# Altium schematic sheet Concentrator.SchDoc
size A2
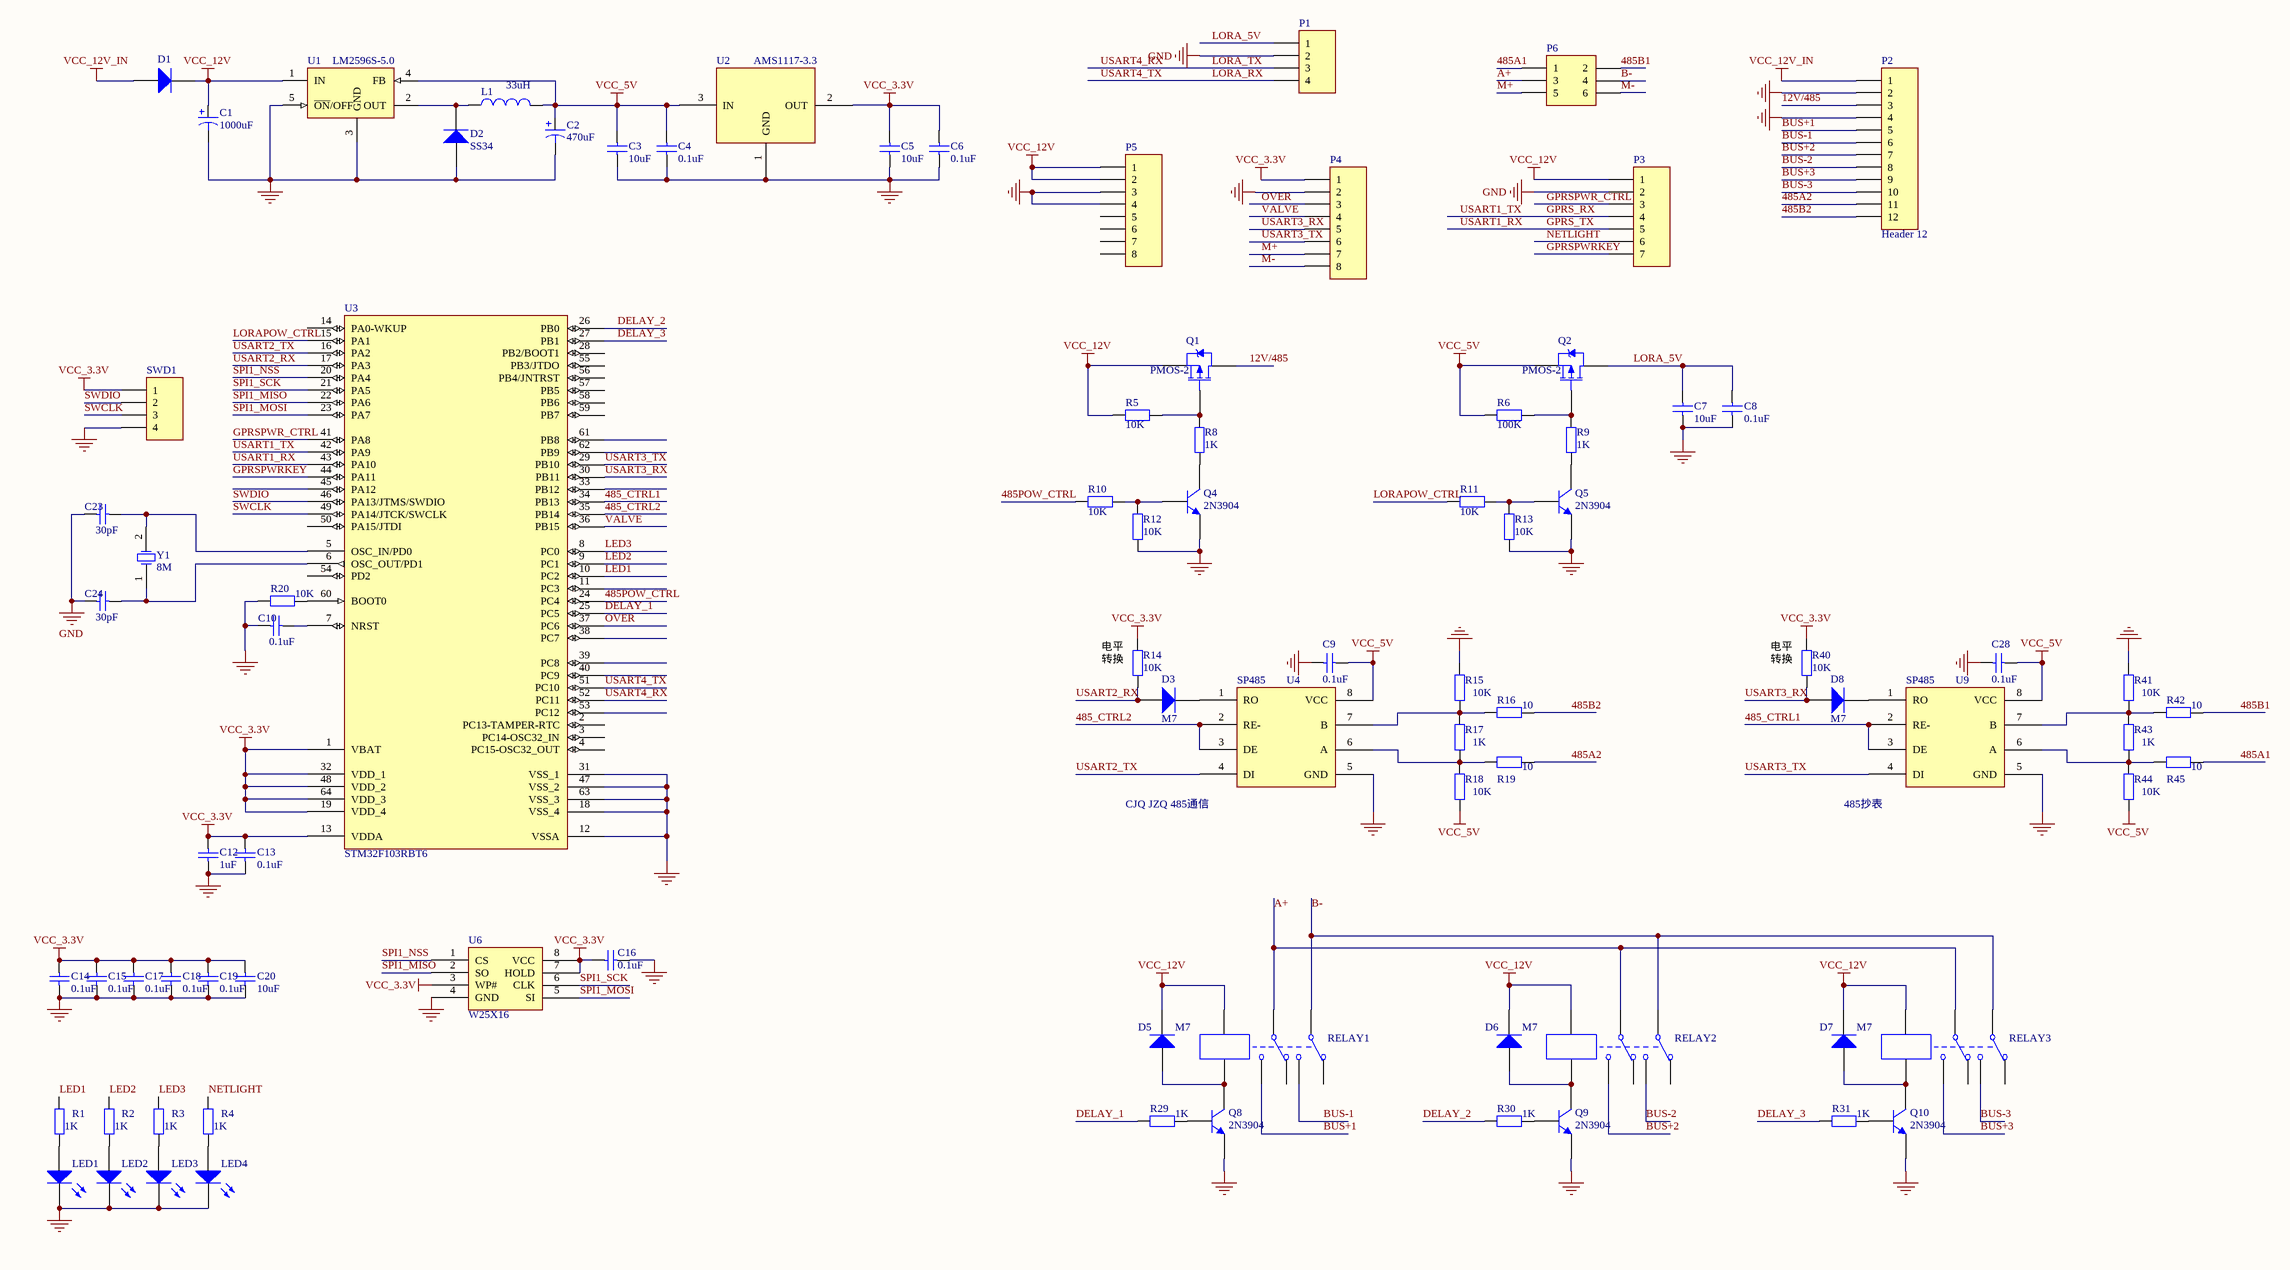
[diagram p0: Concentrator.SchDoc]

## Parts
C1  value 1000uF  [C_DJ - duplicate]  (hidden comment: Cap Pol1)
C2  value 470uF  [C_DJ - duplicate]  (hidden comment: Cap Pol1)
C3  value 10uF  [0805]  (hidden comment: Cap)
C4  value 0.1uF  [0603]  (hidden comment: Cap)
C5  value 10uF  [0805]  (hidden comment: Cap)
C6  value 0.1uF  [0603]  (hidden comment: Cap)
C7  value 10uF  [0805]  (hidden comment: Cap)
C8  value 0.1uF  [0603]  (hidden comment: Cap)
C9  value 0.1uF  [0603]  (hidden comment: Cap)
C10  value 0.1uF  [0603]  (hidden comment: Cap)
C12  value 1uF  [0603]  (hidden comment: Cap)
C13  value 0.1uF  [0603]  (hidden comment: Cap)
C14  value 0.1uF  [0603]  (hidden comment: Cap)
C15  value 0.1uF  [0603]  (hidden comment: Cap)
C16  value 0.1uF  [0603]  (hidden comment: Cap)
C17  value 0.1uF  [0603]  (hidden comment: Cap)
C18  value 0.1uF  [0603]  (hidden comment: Cap)
C19  value 0.1uF  [0603]  (hidden comment: Cap)
C20  value 10uF  [0805]  (hidden comment: Cap)
C23  value 30pF  [0603]  (hidden comment: Cap)
C24  value 30pF  [0603]  (hidden comment: Cap)
C28  value 0.1uF  [0603]  (hidden comment: Cap)
D1  Diode 1N4007  [M7-4007]  (value not drawn)
D2  SS34  [M7-4007]
D3  M7  [M7-4007]
D5  M7  [M7-4007]
D6  M7  [M7-4007]
D7  M7  [M7-4007]
D8  M7  [M7-4007]
L1  value 33uH  [L12*12]  (hidden comment: Inductor)
LED1  LED  [LED]  (value not drawn)
LED2  LED  [LED]  (value not drawn)
LED3  LED  [LED]  (value not drawn)
LED4  LED  [LED]  (value not drawn)
P1  Header 4  [HDR1X4]  (value not drawn)
P2  Header 12  [P12]
P3  Header 7  [HDR1X7]  (value not drawn)
P4  Header 8  [HDR1X8]  (value not drawn)
P5  Header 8  [HDR1X8]  (value not drawn)
P6  Header 3X2  [HDR2X3]  (value not drawn)
Q1  PMOS-2  [78M05/20]
Q2  PMOS-2  [78M05/20]
Q4  2N3904  [NPN-PNP]
Q5  2N3904  [NPN-PNP]
Q8  2N3904  [NPN-PNP]
Q9  2N3904  [NPN-PNP]
Q10  2N3904  [NPN-PNP]
R1  value 1K  [0603]  (hidden comment: Res2)
R2  value 1K  [0603]  (hidden comment: Res2)
R3  value 1K  [0603]  (hidden comment: Res2)
R4  value 1K  [0603]  (hidden comment: Res2)
R5  value 10K  [0603]  (hidden comment: Res2)
R6  value 100K  [0603]  (hidden comment: Res2)
R8  value 1K  [0603]  (hidden comment: Res2)
R9  value 1K  [0603]  (hidden comment: Res2)
R10  value 10K  [0603]  (hidden comment: Res2)
R11  value 10K  [0603]  (hidden comment: Res2)
R12  value 10K  [0603]  (hidden comment: Res2)
R13  value 10K  [0603]  (hidden comment: Res2)
R14  value 10K  [0603]  (hidden comment: Res2)
R15  value 10K  [0603]  (hidden comment: Res2)
R16  value 10  [0603]  (hidden comment: Res2)
R17  value 1K  [0603]  (hidden comment: Res2)
R18  value 10K  [0603]  (hidden comment: Res2)
R19  value 10  [0603]  (hidden comment: Res2)
R20  value 10K  [0603]  (hidden comment: Res2)
R29  value 1K  [0603]  (hidden comment: Res2)
R30  value 1K  [0603]  (hidden comment: Res2)
R31  value 1K  [0603]  (hidden comment: Res2)
R40  value 10K  [0603]  (hidden comment: Res2)
R41  value 10K  [0603]  (hidden comment: Res2)
R42  value 10  [0603]  (hidden comment: Res2)
R43  value 1K  [0603]  (hidden comment: Res2)
R44  value 10K  [0603]  (hidden comment: Res2)
R45  value 10  [0603]  (hidden comment: Res2)
RELAY1  Relay-DPDT  [Relay-DPDP]  (value not drawn)
RELAY2  Relay-DPDT  [Relay-DPDP]  (value not drawn)
RELAY3  Relay-DPDT  [Relay-DPDP]  (value not drawn)
SWD1  SWD  [HDR1X4]  (value not drawn)
U1  LM2596S-5.0  [TO-263-5]
U2  AMS1117-3.3  [AMS-1117]
U3  STM32F103RBT6  [LQFP64_M]
U4  SP485  [SOP8]
U6  W25X16  [W24X16]
U9  SP485  [SOP8]
Y1  8M  [OSC]

## Nets
GND: C1.2 C2.2 C3.1 C4.1 C5.1 C6.1 C7.1 C8.1 C9.2 C10.1 C12.1 C13.1 C14.1 C15.1 C16.1 C17.1 C18.1 C19.1 C20.1 C23.1 C24.1 C28.2 D2.1(A) LED1.K LED2.K LED3.K LED4.K P1.2 P2.2 P2.4 P3.2 P4.2 P5.3 P5.4 Q4.E Q5.E Q8.E Q9.E Q10.E R12.1 R13.1 R15.1 R20.1 R41.1 SWD1.4 U1.3(GND) U1.5(~{ON}/OFF) U2.1(GND) U3.12(VSSA) U3.18(VSS_4) U3.31(VSS_1) U3.47(VSS_2) U3.63(VSS_3) U4.5(GND) U6.4(GND) U9.5(GND)
VCC_3.3V: C5.2 C6.2 C12.2 C13.2 C14.2 C15.2 C16.2 C17.2 C18.2 C19.2 C20.2 P4.1 R14.1 R40.1 SWD1.1 U2.2(OUT) U3.1(VBAT) U3.13(VDDA) U3.19(VDD_4) U3.32(VDD_1) U3.48(VDD_2) U3.64(VDD_3) U6.3(WP#) U6.7(HOLD) U6.8(VCC)
VCC_5V: C2.1 C3.2 C4.2 C9.1 C28.1 L1.2 Q2.3(S) R6.2 R18.2 R44.2 U1.4(FB) U2.3(IN) U4.8(VCC) U9.8(VCC)
VCC_12V: C1.1 D1.2(K) D5.2(K) D6.2(K) D7.2(K) P3.1 P5.1 P5.2 Q1.3(S) R5.2 RELAY1.7 RELAY2.7 RELAY3.7 U1.1(IN)
VCC_12V_IN: D1.1(A) P2.1
12V/485: P2.3 Q1.2(D)
485_CTRL1: U3.34(PB13) U9.2(RE-) U9.3(DE)
485_CTRL2: U3.35(PB14) U4.2(RE-) U4.3(DE)
485A1: P6.1 R45.2
485A2: P2.11 R19.2
485B1: P6.2 R42.2
485B2: P2.12 R16.2
485POW_CTRL: R10.1 U3.24(PC4)
A+: P6.3 RELAY1.4 RELAY2.4 RELAY3.4
B-: P6.4 RELAY1.1 RELAY2.1 RELAY3.1
BUS+1: P2.5 RELAY1.6
BUS+2: P2.7 RELAY2.6
BUS+3: P2.9 RELAY3.6
BUS-1: P2.6 RELAY1.3
BUS-2: P2.8 RELAY2.3
BUS-3: P2.10 RELAY3.3
DELAY_1: R29.1 U3.25(PC5)
DELAY_2: R30.1 U3.26(PB0)
DELAY_3: R31.1 U3.27(PB1)
GPRS_RX: P3.4 U3.42(PA9)  [also labelled USART1_TX]
GPRS_TX: P3.5 U3.43(PA10)  [also labelled USART1_RX]
GPRSPWR_CTRL: P3.3 U3.41(PA8)
GPRSPWRKEY: P3.7 U3.44(PA11)
LED1: R1.1 U3.10(PC2)
LED2: R2.1 U3.9(PC1)
LED3: R3.1 U3.8(PC0)
LORA_5V: C7.2 C8.2 P1.1 Q2.2(D)
LORA_RX: P1.4 U3.51(PC10)  [also labelled USART4_TX]
LORA_TX: P1.3 U3.52(PC11)  [also labelled USART4_RX]
LORAPOW_CTRL: R11.1 U3.15(PA1)
M+: P4.7 P6.5
M-: P4.8 P6.6
NETLIGHT: P3.6 R4.1
OVER: P4.3 U3.37(PC6)
SPI1_MISO: U3.22(PA6) U6.2(SO)
SPI1_MOSI: U3.23(PA7) U6.5(SI)
SPI1_NSS: U3.20(PA4) U6.1(CS)
SPI1_SCK: U3.21(PA5) U6.6(CLK)
SWCLK: SWD1.3 U3.49(PA14/JTCK/SWCLK)
SWDIO: SWD1.2 U3.46(PA13/JTMS/SWDIO)
USART2_RX: D3.1(A) R14.2 U3.17(PA3)
USART2_TX: U3.16(PA2) U4.4(DI)
USART3_RX: D8.1(A) P4.5 R40.2 U3.30(PB11)
USART3_TX: P4.6 U3.29(PB10) U9.4(DI)
VALVE: P4.4 U3.36(PB15)
NetC10_2: C10.2 U3.7(NRST)
NetC23_2: C23.2 U3.5(OSC_IN/PD0) Y1.2(OSC2)
NetC24_2: C24.2 U3.6(OSC_OUT/PD1) Y1.1(OSC1)
NetD2_2: D2.2(K) L1.1 U1.2(OUT)
NetD3_2: D3.2(K) U4.1(RO)
NetD5_1: D5.1(A) Q8.C RELAY1.8
NetD6_1: D6.1(A) Q9.C RELAY2.8
NetD7_1: D7.1(A) Q10.C RELAY3.8
NetD8_2: D8.2(K) U9.1(RO)
NetLED1_A: LED1.A R1.2
NetLED2_A: LED2.A R2.2
NetLED3_A: LED3.A R3.2
NetLED4_A: LED4.A R4.2
NetQ1_1: Q1.1(G) R5.1 R8.2
NetQ2_1: Q2.1(G) R6.1 R9.2
NetQ4_B: Q4.B R10.2 R12.2
NetQ4_C: Q4.C R8.1
NetQ5_B: Q5.B R11.2 R13.2
NetQ5_C: Q5.C R9.1
NetQ8_B: Q8.B R29.2
NetQ9_B: Q9.B R30.2
NetQ10_B: Q10.B R31.2
NetR15_2: R15.2 R16.1 R17.1 U4.7(B)
NetR17_2: R17.2 R18.1 R19.1 U4.6(A)
NetR20_2: R20.2 U3.60(BOOT0)
NetR41_2: R41.2 R42.1 R43.1 U9.7(B)
NetR43_2: R43.2 R44.1 R45.1 U9.6(A)

Not connected (* = marked no-connect by the designer): P5 5 6 7 8; RELAY1 2 5; RELAY2 2 5; RELAY3 2 5; U2 4(OUT); U3 2(PC13-TAMPER-RTC) 3(PC14-OSC32_IN) 4(PC15-OSC32_OUT) 11(PC3) 14(PA0-WKUP) 28(PB2/BOOT1) 33(PB12) 38(PC7) 39(PC8) 40(PC9) 45(PA12) 50(PA15/JTDI) 53(PC12) 54(PD2) 55(PB3/JTDO) 56(PB4/JNTRST) 57(PB5) 58(PB6) 59(PB7) 61(PB8) 62(PB9)

## Notes on the sheet
- (near R14) 电平
  转换
- (near R40) 电平
  转换
- (near U4) CJQ JZQ 485通信
- (near U9) 485抄表

## Library data of the parts
C1 C2 = Cap Pol1: Polarized Capacitor (Radial); Published: 8-Jun-2000; LatestRevisionDate: 17-Jul-2002; LatestRevisionNote: Re-released for DXP Platform.; PackageReference: RB7.6-15; Publisher: Altium Limited
C3-C10 C12-C20 C23 C24 C28 = Cap: Capacitor; Published: 8-Jun-2000; LatestRevisionDate: 17-Jul-2002; LatestRevisionNote: Re-released for DXP Platform.; PackageReference: RAD-0.3; Publisher: Altium Limited
D1-D3 D5-D8 = Diode 1N4007: 1 Amp General Purpose Rectifier; Published: 8-Jun-2000; LatestRevisionDate: 17-Jul-2002; LatestRevisionNote: Re-released for DXP Platform.; PackageReference: DO-41; Publisher: Altium Limited; Code_JEDEC: DO-204-AL; ComponentLink1Description: Manufacturer Link; ComponentLink1URL: http://www.fairchildsemi.com/; ComponentLink2Description: Datasheet; ComponentLink2URL: http://www.fairchildsemi.com/ds/1N%2F1N4001.pdf
  D1 D2: DatasheetVersion: 1998; PackageVersion: Aug-1999
  D3 D5-D8: DatasheetDocument: 1998; PackageDocument: Aug-1999
L1 = Inductor: Code_IEC: 1005; Published: 8-Jun-2000; LatestRevisionDate: 29-May-2009; LatestRevisionNote: IPC-7351 Footprint Added.; PackageReference: 0402-A; Publisher: Altium Limited; PackageDescription: Chip Inductor; Code_JEITA: 0402
LED1-LED4 = LED0: Typical INFRARED GaAs LED; Published: 8-Jun-2000; LatestRevisionDate: 08-Jul-2005; LatestRevisionNote: Mech Layer 1 removed.; PackageReference: LED-0; Publisher: Altium Limited
P1 SWD1 = Header 4: Header, 4-Pin; LatestRevisionDate: 17-Jul-2002; LatestRevisionNote: Re-released for DXP Platform.; Publisher: Altium Limited
P2 = Header 12: Header, 12-Pin; LatestRevisionDate: 17-Jul-2002; LatestRevisionNote: Re-released for DXP Platform.; Publisher: Altium Limited
P3 = Header 7: Header, 7-Pin; LatestRevisionDate: 17-Jul-2002; LatestRevisionNote: Re-released for DXP Platform.; Publisher: Altium Limited
P4 P5 = Header 8: Header, 8-Pin; LatestRevisionDate: 17-Jul-2002; LatestRevisionNote: Re-released for DXP Platform.; Publisher: Altium Limited
P6 = Header 3X2: Header, 3-Pin, Dual row; LatestRevisionDate: 17-Jul-2002; LatestRevisionNote: Re-released for DXP Platform.; Publisher: Altium Limited
Q1 Q2 = PMOS-2: P-Channel Power MOSFET; Note: Pin 4 not drawn and electrically connected to Pin 2.; Published: 8-Jun-2000; LatestRevisionDate: 17-Jul-2002; LatestRevisionNote: Re-released for DXP Platform.; DatasheetVersion: PD-9.390D; PackageReference: TO-220AB; Publisher: Altium Limited; Code_JEDEC: TO-220-AB; ComponentLink1Description: Manufacturer Link; ComponentLink1URL: http://www.irf.com/
Q4 Q5 Q8-Q10 = 2N3904: NPN General Purpose Amplifier; Published: 8-Jun-2000; LatestRevisionDate: 15-Jan-2003; LatestRevisionNote: PCB Footprint 'BCY-W3/D4.7' replaced; PackageReference: TO-92A; Publisher: Altium Limited; Code_JEDEC: TO-92A; ComponentLink1Description: Manufacturer Link; ComponentLink1URL: http://www.fairchildsemi.com/; ComponentLink2Description: Datasheet; ComponentLink2URL: http://www.fairchildsemi.com/ds/2N%2F2N3904.pdf
  Q4 Q5: DatasheetVersion: 1997; PackageVersion: Sep-1998
  Q8-Q10: DatasheetDocument: 1997; PackageDocument: Sep-1998
R1-R6 R8-R20 R29-R31 R40-R45 = Res2: Resistor; Published: 8-Jun-2000; LatestRevisionDate: 17-Jul-2002; LatestRevisionNote: Re-released for DXP Platform.; PackageReference: AXIAL-0.4; Publisher: Altium Limited
RELAY1-RELAY3 = Relay-DPDT: Dual-Pole Dual-Throw Relay; Published: 24-Mar-1999; LatestRevisionDate: 17-Jul-2002; LatestRevisionNote: Re-released for DXP Platform.; PackageReference: DIP-P8; Publisher: Altium Limited
U1 = LM2596S-5.0: 5V稳压芯片; Note: Tab is connected to GND; Published: 15-Apr-2002; DatasheetVersion: Dec-1997; PackageReference: TS5B; Publisher: Altium Limited; PackageDescription: D2-PAK; 5 Leads; Body 14.4 (inc. leads) x 10.4 mm (LxW max); ComponentLink1Description: Manufacturer Link; ComponentLink1URL: http://www.national.com/; ComponentLink2Description: Datasheet; ComponentLink2URL: http://www.national.com/ds.cgi/LM/LM2596.pdf; ComponentLink3Description: URL Link1; ComponentLink3URL: http://www.national.com/pf/LM/LM2596.html
U3 = STM32F103RBT6: STM32 ARM-based 32-bit MCU with 128 Kbytes Flash, 64-pin LQFP, Industrial Temperature; Published: 30-May-2008; DatasheetVersion: rev6, Mar-2008; PackageVersion: Mar-2008; PackageReference: LQFP64; Publisher: Altium Limited; PackageDescription: 64-Pin Low-Profile Quad Flat Pack, 10 x 10 mm Body, 0.5 mm Pitch (LQFP64); ComponentLink1Description: Manufacturer Link; ComponentLink1URL: www.st.com/stm32; ComponentLink2Description: Datasheet; ComponentLink2URL: http://www.st.com/stonline/products/literature/ds/13587.pdf
U4 U9 = Pro55.tmp_SP485_20
U6 = W24X16
Y1 = XTAL: Crystal Oscillator; Published: 8-Jun-2000; LatestRevisionDate: 17-Jul-2002; LatestRevisionNote: Re-released for DXP Platform.; PackageReference: R38; Publisher: Altium Limited